# EAGLE design PaxInstrument-T400 (EAGLE 6.5.0)
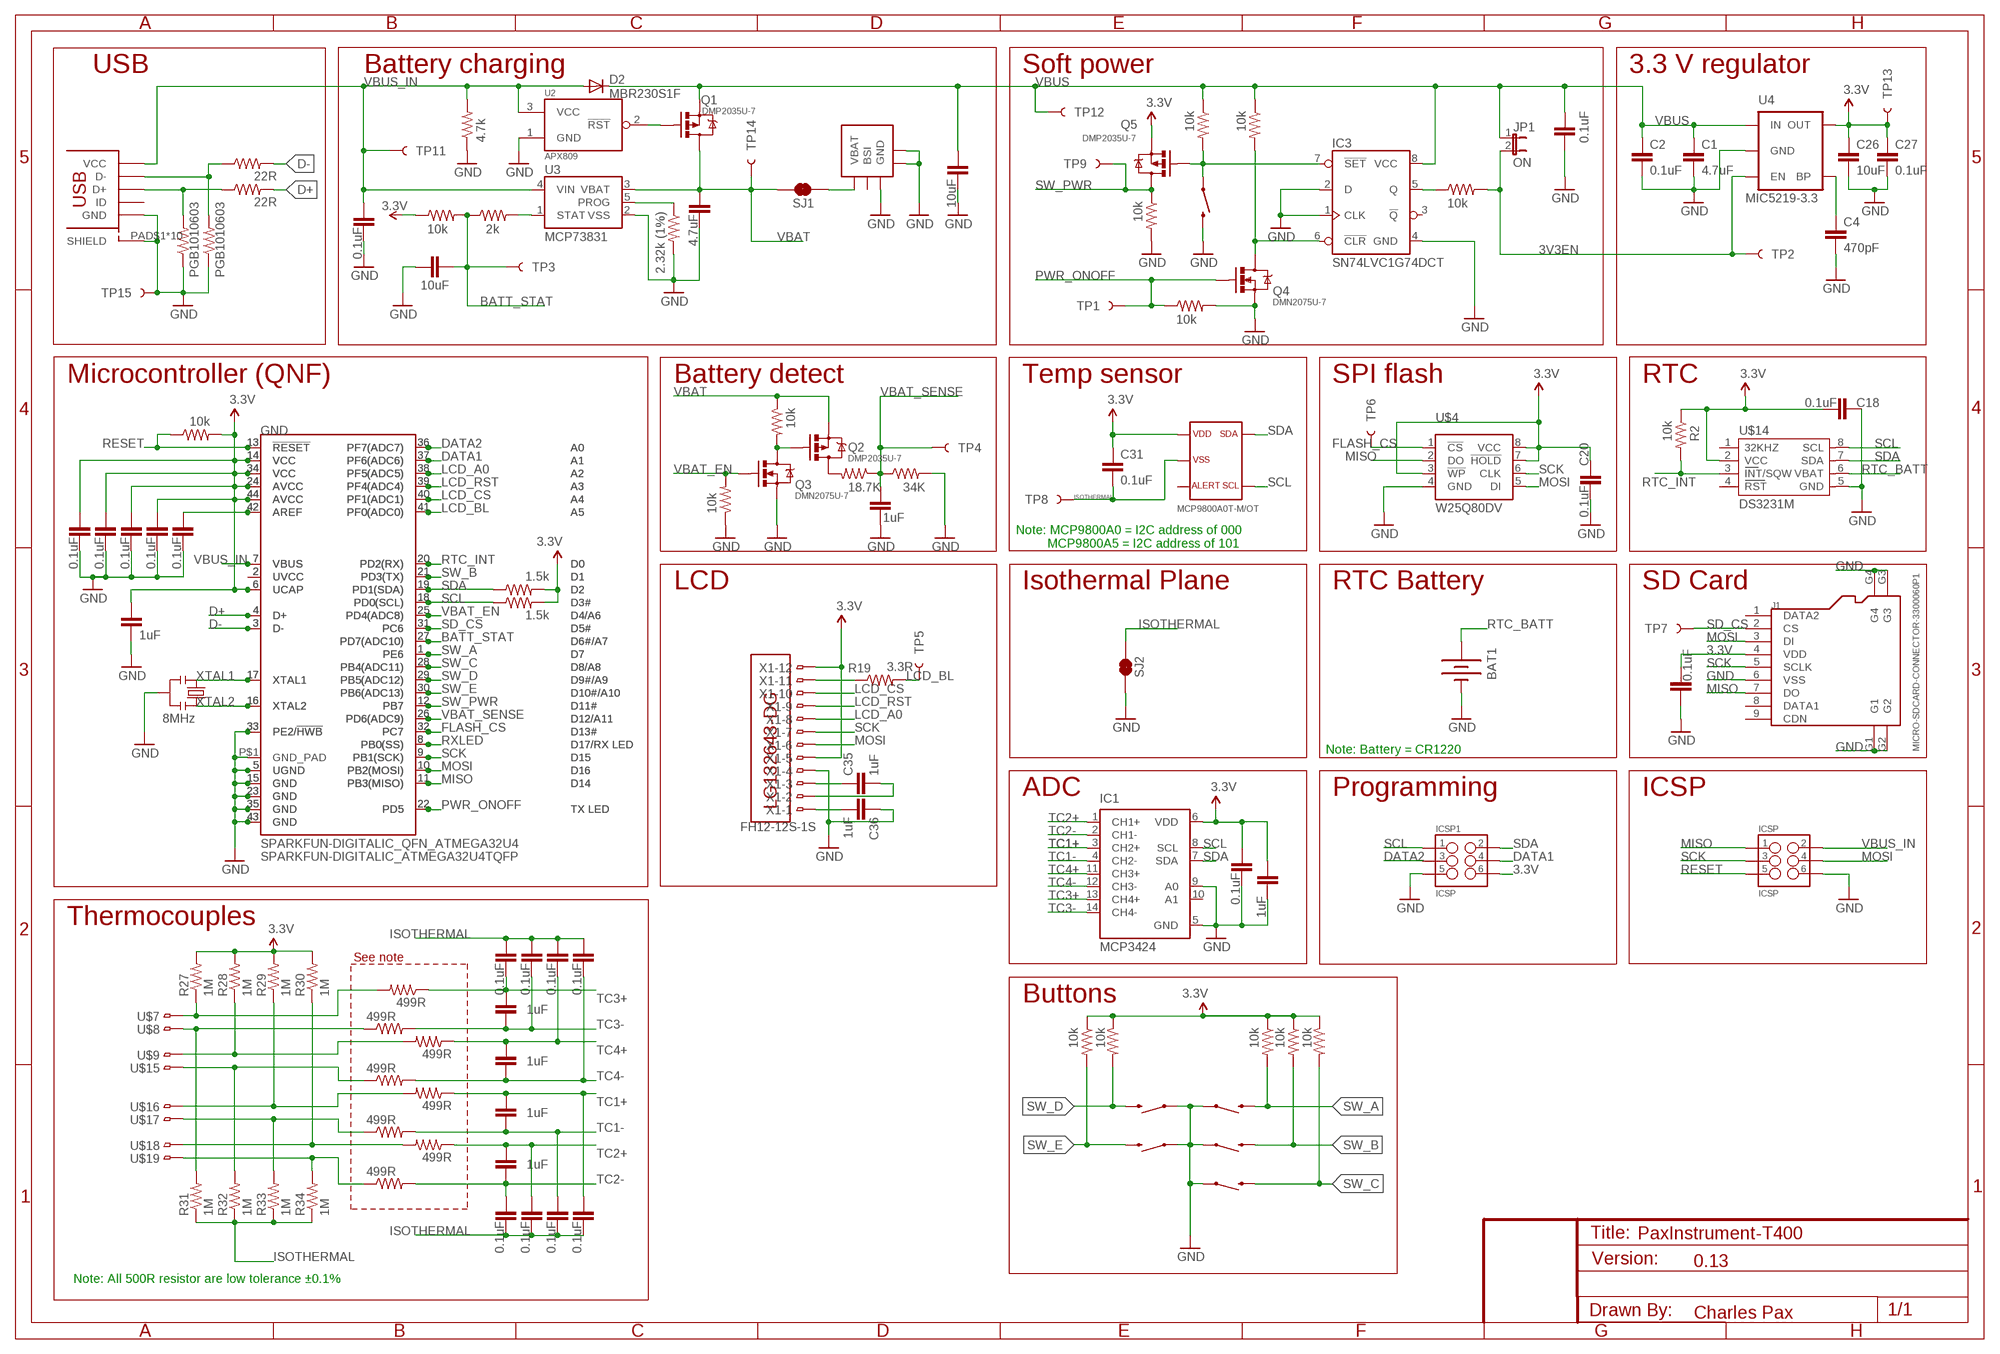
[diagram p0: schematic, sheet 1]

## Parts
BAT1  BATTERY12MM  [BATTCON_12MM]
C1  4.7uF  SPARKFUN-CAPACITORS_CAP0603-CAP  [SPARKFUN-CAPACITORS_0603-CAP]
C2  0.1uF  SPARKFUN-CAPACITORS_CAP0603-CAP  [SPARKFUN-CAPACITORS_0603-CAP]
C3  0.1uF  SPARKFUN-CAPACITORS_CAP0603-CAP  [SPARKFUN-CAPACITORS_0603-CAP]
C4  470pF  SPARKFUN-CAPACITORS_CAP0603-CAP  [SPARKFUN-CAPACITORS_0603-CAP]
C5  0.1uF  SPARKFUN-CAPACITORS_CAP0603-CAP  [SPARKFUN-CAPACITORS_0603-CAP]
C6  0.1uF  SPARKFUN-CAPACITORS_CAP0603-CAP  [SPARKFUN-CAPACITORS_0603-CAP]
C7  1uF  SPARKFUN-CAPACITORS_CAP0603-CAP  [SPARKFUN-CAPACITORS_0603-CAP]
C8  1uF  SPARKFUN-CAPACITORS_CAP0603-CAP  [SPARKFUN-CAPACITORS_0603-CAP]
C9  4.7uF  SPARKFUN-CAPACITORS_CAP0603-CAP  [SPARKFUN-CAPACITORS_0603-CAP]
C10  1uF  SPARKFUN-CAPACITORS_CAP0603-CAP  [SPARKFUN-CAPACITORS_0603-CAP]
C11  1uF  SPARKFUN-CAPACITORS_CAP0603-CAP  [SPARKFUN-CAPACITORS_0603-CAP]
C12  10uF  SPARKFUN-CAPACITORS_CAP0603-CAP  [SPARKFUN-CAPACITORS_0603-CAP]
C13  0.1uF  SPARKFUN-CAPACITORS_CAP0603-CAP  [SPARKFUN-CAPACITORS_0603-CAP]
C14  0.1uF  SPARKFUN-CAPACITORS_CAP0603-CAP  [SPARKFUN-CAPACITORS_0603-CAP]
C15  0.1uF  SPARKFUN-CAPACITORS_CAP0603-CAP  [SPARKFUN-CAPACITORS_0603-CAP]
C16  0.1uF  SPARKFUN-CAPACITORS_CAP0603-CAP  [SPARKFUN-CAPACITORS_0603-CAP]
C17  0.1uF  SPARKFUN-CAPACITORS_CAP0603-CAP  [SPARKFUN-CAPACITORS_0603-CAP]
C18  0.1uF  SPARKFUN-CAPACITORS_CAP0603-CAP  [SPARKFUN-CAPACITORS_0603-CAP]
C19  1uF  SPARKFUN-CAPACITORS_CAP0603-CAP  [SPARKFUN-CAPACITORS_0603-CAP]
C20  0.1uF  SPARKFUN-CAPACITORS_CAP0603-CAP  [SPARKFUN-CAPACITORS_0603-CAP]
C21  0.1uF  SPARKFUN-CAPACITORS_CAP0603-CAP  [SPARKFUN-CAPACITORS_0603-CAP]
C22  10uF  SPARKFUN-CAPACITORS_CAP0603-CAP  [SPARKFUN-CAPACITORS_0603-CAP]
C23  1uF  SPARKFUN-CAPACITORS_CAP0603-CAP  [SPARKFUN-CAPACITORS_0603-CAP]
C24  0.1uF  SPARKFUN-CAPACITORS_CAP0603-CAP  [SPARKFUN-CAPACITORS_0603-CAP]
C25  0.1uF  SPARKFUN-CAPACITORS_CAP0603-CAP  [SPARKFUN-CAPACITORS_0603-CAP]
C26  10uF  SPARKFUN-CAPACITORS_CAP0603-CAP  [SPARKFUN-CAPACITORS_0603-CAP]
C27  0.1uF  SPARKFUN-CAPACITORS_CAP0603-CAP  [SPARKFUN-CAPACITORS_0603-CAP]
C28  0.1uF  SPARKFUN-CAPACITORS_CAP0603-CAP  [SPARKFUN-CAPACITORS_0603-CAP]
C29  0.1uF  SPARKFUN-CAPACITORS_CAP0603-CAP  [SPARKFUN-CAPACITORS_0603-CAP]
C30  1uF  SPARKFUN-CAPACITORS_CAP0603-CAP  [SPARKFUN-CAPACITORS_0603-CAP]
C31  0.1uF  SPARKFUN-CAPACITORS_CAP0603-CAP  [SPARKFUN-CAPACITORS_0603-CAP]
C32  0.1uF  SPARKFUN-CAPACITORS_CAP0603-CAP  [SPARKFUN-CAPACITORS_0603-CAP]
C33  0.1uF  SPARKFUN-CAPACITORS_CAP0603-CAP  [SPARKFUN-CAPACITORS_0603-CAP]
C34  0.1uF  SPARKFUN-CAPACITORS_CAP0603-CAP  [SPARKFUN-CAPACITORS_0603-CAP]
C35  1uF  SPARKFUN-CAPACITORS_CAP0603-CAP  [SPARKFUN-CAPACITORS_0603-CAP]
C36  1uF  SPARKFUN-CAPACITORS_CAP0603-CAP  [SPARKFUN-CAPACITORS_0603-CAP]
C37  0.1uF  SPARKFUN-CAPACITORS_CAP0603-CAP  [SPARKFUN-CAPACITORS_0603-CAP]
D2  MBR230S1F  SPARKFUN-DISCRETESEMI_DIODESOD123SOD123  [SOD123]
GND  SPARKFUN-DIGITALIC_QFN_ATMEGA32U4  [SPARKFUN-DIGITALIC_SPARKFUN-DIGITALIC_QFN-44]
IC1  MCP3424  [SO14]
IC3  SN74LVC1G74DCT  [SSOP8]
ICSP  ICSP  SPARKFUN-CONNECTORS_M03X2PAX  [SPARKFUN-CONNECTORS_2X3_SMT_POSTS_PAXINSTRUMENT]
ICSP1  ICSP  SPARKFUN-CONNECTORS_M03X2PAX  [SPARKFUN-CONNECTORS_2X3_SMT_POSTS_PAXINSTRUMENT]
J1  MICRO-SDCARD-CONNECTOR-3300060P1  [9P-SMD-W-RING]
JP1  ON  JUMPER-2SMD-NO  [SJ_2S-NO]
Q1  DMP2035U-7  MOSFET-PCHANNELSMT  [SOT23]
Q2  DMP2035U-7  MOSFET-PCHANNELSMT  [SOT23]
Q3  DMN2075U-7  MOSFET-NCHANNELSMT  [SOT23]
Q4  DMN2075U-7  MOSFET-NCHANNELSMT  [SOT23]
Q5  DMP2035U-7  MOSFET-PCHANNELSMT  [SOT23]
R1  10k  SPARKFUN-RESISTORS_RESISTOR0603-RES  [SPARKFUN-RESISTORS_0603-RES]
R2  10k  SPARKFUN-RESISTORS_RESISTOR0603-RES  [SPARKFUN-RESISTORS_0603-RES]
R3  2.32k (1%)  SPARKFUN-RESISTORS_RESISTOR0603-RES  [SPARKFUN-RESISTORS_0603-RES]
R4  10k  SPARKFUN-RESISTORS_RESISTOR0603-RES  [SPARKFUN-RESISTORS_0603-RES]
R5  10k  SPARKFUN-RESISTORS_RESISTOR0603-RES  [SPARKFUN-RESISTORS_0603-RES]
R6  10k  SPARKFUN-RESISTORS_RESISTOR0603-RES  [SPARKFUN-RESISTORS_0603-RES]
R7  10k  SPARKFUN-RESISTORS_RESISTOR0603-RES  [SPARKFUN-RESISTORS_0603-RES]
R8  10k  SPARKFUN-RESISTORS_RESISTOR0603-RES  [SPARKFUN-RESISTORS_0603-RES]
R9  22R  SPARKFUN-RESISTORS_RESISTOR0603-RES  [SPARKFUN-RESISTORS_0603-RES]
R10  22R  SPARKFUN-RESISTORS_RESISTOR0603-RES  [SPARKFUN-RESISTORS_0603-RES]
R11  10k  SPARKFUN-RESISTORS_RESISTOR0603-RES  [SPARKFUN-RESISTORS_0603-RES]
R12  10k  SPARKFUN-RESISTORS_RESISTOR0603-RES  [SPARKFUN-RESISTORS_0603-RES]
R13  1.5k  SPARKFUN-RESISTORS_RESISTOR0603-RES  [SPARKFUN-RESISTORS_0603-RES]
R14  1.5k  SPARKFUN-RESISTORS_RESISTOR0603-RES  [SPARKFUN-RESISTORS_0603-RES]
R15  10k  SPARKFUN-RESISTORS_RESISTOR0603-RES  [SPARKFUN-RESISTORS_0603-RES]
R16  10k  SPARKFUN-RESISTORS_RESISTOR0603-RES  [SPARKFUN-RESISTORS_0603-RES]
R17  2k  SPARKFUN-RESISTORS_RESISTOR0603-RES  [SPARKFUN-RESISTORS_0603-RES]
R18  10k  SPARKFUN-RESISTORS_RESISTOR0603-RES  [SPARKFUN-RESISTORS_0603-RES]
R19  3.3R  SPARKFUN-RESISTORS_RESISTOR0603-RES  [SPARKFUN-RESISTORS_0603-RES]
R20  18.7K  SPARKFUN-RESISTORS_RESISTOR0603-RES  [SPARKFUN-RESISTORS_0603-RES]
R21  10k  SPARKFUN-RESISTORS_RESISTOR0603-RES  [SPARKFUN-RESISTORS_0603-RES]
R22  10k  SPARKFUN-RESISTORS_RESISTOR0603-RES  [SPARKFUN-RESISTORS_0603-RES]
R23  10k  SPARKFUN-RESISTORS_RESISTOR0603-RES  [SPARKFUN-RESISTORS_0603-RES]
R24  34K  SPARKFUN-RESISTORS_RESISTOR0603-RES  [SPARKFUN-RESISTORS_0603-RES]
R25  4.7k  SPARKFUN-RESISTORS_RESISTOR0603-RES  [SPARKFUN-RESISTORS_0603-RES]
R27  1M  SPARKFUN-RESISTORS_RESISTOR0603-RES  [SPARKFUN-RESISTORS_0603-RES]
R28  1M  SPARKFUN-RESISTORS_RESISTOR0603-RES  [SPARKFUN-RESISTORS_0603-RES]
R29  1M  SPARKFUN-RESISTORS_RESISTOR0603-RES  [SPARKFUN-RESISTORS_0603-RES]
R30  1M  SPARKFUN-RESISTORS_RESISTOR0603-RES  [SPARKFUN-RESISTORS_0603-RES]
R31  1M  SPARKFUN-RESISTORS_RESISTOR0603-RES  [SPARKFUN-RESISTORS_0603-RES]
R32  1M  SPARKFUN-RESISTORS_RESISTOR0603-RES  [SPARKFUN-RESISTORS_0603-RES]
R33  1M  SPARKFUN-RESISTORS_RESISTOR0603-RES  [SPARKFUN-RESISTORS_0603-RES]
R34  1M  SPARKFUN-RESISTORS_RESISTOR0603-RES  [SPARKFUN-RESISTORS_0603-RES]
R35  499R  SPARKFUN-RESISTORS_RESISTOR0603-RES  [SPARKFUN-RESISTORS_0603-RES]
R36  499R  SPARKFUN-RESISTORS_RESISTOR0603-RES  [SPARKFUN-RESISTORS_0603-RES]
R37  499R  SPARKFUN-RESISTORS_RESISTOR0603-RES  [SPARKFUN-RESISTORS_0603-RES]
R38  499R  SPARKFUN-RESISTORS_RESISTOR0603-RES  [SPARKFUN-RESISTORS_0603-RES]
R39  499R  SPARKFUN-RESISTORS_RESISTOR0603-RES  [SPARKFUN-RESISTORS_0603-RES]
R40  499R  SPARKFUN-RESISTORS_RESISTOR0603-RES  [SPARKFUN-RESISTORS_0603-RES]
R41  499R  SPARKFUN-RESISTORS_RESISTOR0603-RES  [SPARKFUN-RESISTORS_0603-RES]
R42  499R  SPARKFUN-RESISTORS_RESISTOR0603-RES  [SPARKFUN-RESISTORS_0603-RES]
S1  SWITCH-MOMENTARY-2SMD  [TACTILE_SWITCH_SMD]
S2  SWITCH-MOMENTARY-2SMD  [TACTILE_SWITCH_SMD]
S3  SWITCH-MOMENTARY-2SMD  [TACTILE_SWITCH_SMD]
S4  SWITCH-MOMENTARY-2SMD  [TACTILE_SWITCH_SMD]
S5  SWITCH-MOMENTARY-2SMD  [TACTILE_SWITCH_SMD]
S6  SWITCH-MOMENTARY-2SMD  [TACTILE_SWITCH_SMD]
SJ1  JUMPER-PAD-2-NC_BY_TRACE  [PAD-JUMPER-2-NC_BY_TRACE_YES_SILK]
SJ2  JUMPER-PAD-2-NC_BY_TRACE  [PAD-JUMPER-2-NC_BY_TRACE_YES_SILK]
TP1  PWR_ONOFF  TEST-POINTTP_15TH_THRU  [TP_15TH]
TP2  3V3_EN  TEST-POINTTP_15TH_THRU  [TP_15TH]
TP3  BATT_STAT  TEST-POINTTP_15TH_THRU  [TP_15TH]
TP4  VBAT_SENSE  TEST-POINTTP_15TH_THRU  [TP_15TH]
TP5  LCD_BL  TEST-POINTTP_15TH_THRU  [TP_15TH]
TP6  FLASH_CS  TEST-POINTTP_15TH_THRU  [TP_15TH]
TP7  SD_CS  TEST-POINTTP_15TH_THRU  [TP_15TH]
TP8  ISOTHERMAL  TEST-POINTTP_15TH_THRU  [TP_15TH]
TP9  SW_PWR  TEST-POINTTP_15TH_THRU  [TP_15TH]
TP11  VBUS_IN  TEST-POINTTP_15TH_THRU  [TP_15TH]
TP12  VBUS  TEST-POINTTP_15TH_THRU  [TP_15TH]
TP13  3.3V  TEST-POINTTP_15TH_THRU  [TP_15TH]
TP14  VBAT  TEST-POINTTP_15TH_THRU  [TP_15TH]
TP15  GND  TEST-POINTTP_15TH_THRU  [TP_15TH]
U1  MCP9800  [SOT23-5L]
U2  APX809  [SOT23]
U3  MCP73831  [SOT23-5]
U4  MIC5219-3.3V  V_REG_LDOSMD  [SOT23-5]
U$1  USB_MICROSMT+THRUHULE  [USB_MICRO_THRUHOLE]
U$2  BL-5C-CONNECTOR  [BL-5C-CONNECTOR]
U$3  SPARKFUN-DIGITALIC_ATMEGA32U4TQFP  [SPARKFUN-DIGITALIC_SPARKFUN-DIGITALIC_TQFP44]
U$4  W25Q80DV  W25Q80BV  [CHARLESPAX_SOIC8M]
U$5  LG132643-DG  [LG132643-DG]
U$7  TC-MINI-SINGLE  [TC-CLIP-SINGLE]
U$8  TC-MINI-SINGLE  [TC-CLIP-SINGLE]
U$9  TC-MINI-SINGLE  [TC-CLIP-SINGLE]
U$14  DS3231M  [SOIC8]
U$15  TC-MINI-SINGLE  [TC-CLIP-SINGLE]
U$16  TC-MINI-SINGLE  [TC-CLIP-SINGLE]
U$17  TC-MINI-SINGLE  [TC-CLIP-SINGLE]
U$18  TC-MINI-SINGLE  [TC-CLIP-SINGLE]
U$19  TC-MINI-SINGLE  [TC-CLIP-SINGLE]
X1  FH12-12S-1S  [FH12-12S-1SH]
Y1  RESONATORSMD  [RESONATOR-SMD]
Z1  PGB1010603  SPARKFUN-RESISTORS_RESISTOR0603-RES  [SPARKFUN-RESISTORS_0603-RES]
Z2  PGB1010603  SPARKFUN-RESISTORS_RESISTOR0603-RES  [SPARKFUN-RESISTORS_0603-RES]

## Nets
3.3V: C5.1 C18.1 C19.1 C20.2 C21.2 C26.1 C27.1 C29.1 C30.1 C31.1 C32.1 C33.1 C34.1 GND.6(UCAP) GND.14(VCC) GND.24(AVCC) GND.34(VCC) GND.44(AVCC) IC1.6(VDD) ICSP1.6 J1.4(VDD) Q5.2(S) R1.1 R2.1 R4.2 R8.1 R11.1 R12.1 R13.2 R14.2 R15.1 R16.1 R27.2 R28.2 R29.2 R30.2 TP13.P$1 U1.1 U4.5(OUT) U$3.6(UCAP) U$3.14(VCC) U$3.24(AVCC) U$3.34(VCC) U$3.44(AVCC) U$4.3(!WP) U$4.7(!HOLD) U$4.8(VCC) U$14.2(VCC) X1.5 X1.12
3V3EN: JP1.2 R21.2 TP2.P$1 U4.3(EN)
BATT_STAT: C22.1 GND.27(PD7(ADC10)) R1.2 R17.1 TP3.P$1 U$3.27(PD7(ADC10))
D+: GND.4(D+) R9.2 U$3.4(D+)
D-: GND.3(D-) R10.2 U$3.3(D-)
DATA1: GND.37(PF6(ADC6)) ICSP1.4 U$3.37(PF6(ADC6))
DATA2: GND.36(PF7(ADC7)) ICSP1.3 U$3.36(PF7(ADC7))
FLASH_CS: GND.32(PC7) TP6.P$1 U$3.32(PC7) U$4.1(!CS)
GND: BAT1.GND(-) C1.2 C2.2 C3.2 C4.2 C5.2 C6.2 C9.2 C12.2 C18.2 C19.2 C20.1 C21.1 C22.2 C23.2 C26.2 C27.2 C28.2 C29.2 C30.2 C32.2 C33.2 C34.2 C36.1 GND.5(UGND) GND.15(GND) GND.23(GND) GND.33(PE2/!HWB) GND.35(GND) GND.43(GND) GND.P$1(GND_PAD) IC1.5(GND) IC1.9(A0) IC3.1(CLK) IC3.2(D) IC3.4(GND) ICSP1.5 ICSP.6 J1.6(VSS) J1.G1 J1.G2 J1.G3 J1.G4 Q3.2(S) Q4.2(S) R3.2 R18.2 R22.2 R23.1 R24.2 R25.1 S1.1 S2.1 S3.1 S4.1 S5.1 S6.3 SJ2.1 TP15.P$1 U2.1(GND) U3.2(VSS) U4.2(GND) U$1.PAD$1(SHIELD) U$1.PAD$2(SHIELD) U$1.PAD$3(SHIELD) U$1.PAD$4(SHIELD) U$1.PAD$5(SHIELD) U$1.PAD$6(SHIELD) U$1.PAD$7(SHIELD) U$1.PAD$8(SHIELD) U$1.PAD$9(SHIELD) U$1.PAD$10(SHIELD) U$1.PIN$5(GND) U$2.P$3(GND) U$2.P$4 U$2.P$5 U$3.5(UGND) U$3.15(GND) U$3.23(GND) U$3.33(PE2/!HWB) U$3.35(GND) U$3.43(GND) U$4.4(GND) U$14.5(GND) X1.4 Y1.2 Z1.1 Z2.1
ISOTHERMAL: C13.2 C14.2 C15.2 C16.2 C17.1 C24.1 C25.1 C31.2 C37.1 R31.1 R32.1 R33.1 R34.1 SJ2.2 TP8.P$1 U1.2
LCD_A0: GND.38(PF5(ADC5)) U$3.38(PF5(ADC5)) X1.8
LCD_BL: GND.41(PF0(ADC0)) R19.2 TP5.P$1 U$3.41(PF0(ADC0))
LCD_CS: GND.40(PF1(ADC1)) U$3.40(PF1(ADC1)) X1.10
LCD_RST: GND.39(PF4(ADC4)) U$3.39(PF4(ADC4)) X1.9
MISO: GND.11(PB3(MISO)) ICSP.1 J1.7(DO) U$3.11(PB3(MISO)) U$4.2(DO)
MOSI: GND.10(PB2(MOSI)) ICSP.4 J1.3(DI) U$3.10(PB2(MOSI)) U$4.5(DI) X1.6
N$1: C4.1 U4.4(BP)
N$2: R17.2 U3.1(STAT)
N$4: R19.1 X1.11
N$5: R31.2 R36.1 U$8.P$1
N$7: R3.1 U3.5(PROG)
N$10: SJ1.2 U$2.P$1(VBAT)
N$11: R27.1 R35.2 U$7.P$1
N$12: Q1.1(G) U2.2(!RST)
N$13: R29.1 R39.2 U$16.P$1
N$14: R33.2 R41.1 U$17.P$1
N$15: C3.1 GND.42(AREF) U$3.42(AREF)
N$16: R34.2 R42.1 U$19.P$1
N$17: GND.2(UVCC) U$3.2(UVCC)
N$20: Q2.3(D) R20.2
N$25: IC3.7(!SET) Q5.1(G) R6.2 S6.1
N$26: Q2.1(G) Q3.3(D) R5.2
N$27: IC3.6(!CLR) Q4.3(D) R7.2
N$28: IC3.5(Q) R21.1
N$31: R10.1 U$1.PIN$2(D-) Z2.2
N$33: R9.1 U$1.PIN$3(D+) Z1.2
N$34: R32.2 R38.1 U$15.P$1
N$35: R28.1 R37.2 U$9.P$1
N$37: C35.1 X1.3
N$38: C35.2 X1.2
N$39: C36.2 X1.1
N$40: R30.1 R40.2 U$18.P$1
PWR_ONOFF: GND.22(PD5) Q4.1(G) R22.1 TP1.P$1 U$3.22(PD5)
RESET: GND.13(!RESET) ICSP.5 R4.1 U$3.13(!RESET)
RTC_BATT: BAT1.PWR@1(+) U$14.6(VBAT)
RTC_INT: GND.20(PD2(RX)) R2.2 U$3.20(PD2(RX)) U$14.3(INT/SQW)
RXLED: GND.8(PB0(SS)) U$3.8(PB0(SS))
SCK: GND.9(PB1(SCK)) ICSP.3 J1.5(SCLK) U$3.9(PB1(SCK)) U$4.6(CLK) X1.7
SCL: GND.18(PD0(SCL)) IC1.8(SCL) ICSP1.1 R14.1 U1.4 U$3.18(PD0(SCL)) U$14.8(SCL)
SD_CS: GND.31(PC6) J1.2(CS) TP7.P$1 U$3.31(PC6)
SDA: GND.19(PD1(SDA)) IC1.7(SDA) ICSP1.2 R13.1 U1.5 U$3.19(PD1(SDA)) U$14.7(SDA)
SW_A: GND.1(PE6) R8.2 S3.3 U$3.1(PE6)
SW_B: GND.21(PD3(TX)) R11.2 S2.3 U$3.21(PD3(TX))
SW_C: GND.28(PB4(ADC11)) R12.2 S1.3 U$3.28(PB4(ADC11))
SW_D: GND.29(PB5(ADC12)) R15.2 S4.3 U$3.29(PB5(ADC12))
SW_E: GND.30(PB6(ADC13)) R16.2 S5.3 U$3.30(PB6(ADC13))
SW_PWR: GND.12(PB7) Q5.3(D) R18.1 TP9.P$1 U$3.12(PB7)
TC1+: C10.1 C16.1 IC1.3(CH2+) R39.1
TC1-: C10.2 C15.1 IC1.4(CH2-) R41.2
TC2+: C11.1 C14.1 IC1.1(CH1+) R40.1
TC2-: C11.2 C13.1 IC1.2(CH1-) R42.2
TC3+: C7.1 C17.2 IC1.13(CH4+) R35.1
TC3-: C7.2 C24.2 IC1.14(CH4-) R36.2
TC4+: C8.1 C25.2 IC1.11(CH3+) R37.1
TC4-: C8.2 C37.2 IC1.12(CH3-) R38.2
VBAT: C9.1 Q1.3(D) Q2.2(S) R5.1 SJ1.1 TP14.P$1 U3.3(VBAT)
VBAT_EN: GND.25(PD4(ADC8)) Q3.1(G) R23.2 U$3.25(PD4(ADC8))
VBAT_SENSE: C23.1 GND.26(PD6(ADC9)) R20.1 R24.1 TP4.P$1 U$3.26(PD6(ADC9))
VBUS [power]: C1.1 C2.1 C12.1 C28.1 D2.C IC3.8(VCC) JP1.1 Q1.2(S) R6.1 R7.1 TP12.P$1 U4.1(IN)
VBUS_IN [power]: C6.1 D2.A GND.7(VBUS) ICSP.2 R25.2 TP11.P$1 U2.3(VCC) U3.4(VIN) U$1.PIN$1(VCC) U$3.7(VBUS)
XTAL1: GND.17(XTAL1) U$3.17(XTAL1) Y1.1
XTAL2: GND.16(XTAL2) U$3.16(XTAL2) Y1.3
Unconnected: IC1.10(A1) IC3.3(!Q) J1.1(DATA2) J1.8(DATA1) J1.9(CDN) U1.3 U$1.PIN$4(ID) U$2.P$2(BSI) U$14.1(32KHZ) U$14.4(RST)

## Notes on the sheet
- USB | Battery charging | Soft power | 3.3 V regulator
- MIC5219-3.3
- Microcontroller (QNF) | Battery detect | Temp sensor | SPI flash | RTC
- Note: MCP9800A0 = I2C address of 000
           MCP9800A5 = I2C address of 101
- LCD | Isothermal Plane | RTC Battery | SD Card
- 8MHz
- Note: Battery = CR1220
- ADC | Programming | ICSP
- Thermocouples
- See note
- Buttons
- 0.13
- Note: All 500R resistor are low tolerance ±0.1%
- Charles Pax

## Library data of the parts
BAT1 = SparkFun-Electromechanical:BATTERY: Battery Holders Various common sizes : AA, AAA, 20mm coin cell and 12mm coin cell. 20MM_4LEGS, BATT-10373; MF: Keystone Electronics; MPN: 3000TR
C1-C37 = PaxInstrument-T400:SPARKFUN-CAPACITORS_CAP: Capacitor Standard 0603 ceramic capacitor, and 0.1" leaded capacitor.
D2 = PaxInstrument-T400:SPARKFUN-DISCRETESEMI_DIODE: Diode These are standard reverse protection diodes and small signal diodes. SMA package can handle up to about 1A. SOD-323 can handle about 200mA. What the SOD-323 package when ordering, there are some mfgs out there that are 5-pin packages.; MF: DIODES INC; MPN: MBR230S1F-7
GND = PaxInstrument-T400:SPARKFUN-DIGITALIC_QFN_ATMEGA32U4; MF: Atmel; MPN: ATMEGA32U4-MU
IC1 = JeeLabs:MCP3424: 18-Bit, 4-Channel Sampling ANALOG-TO-DIGITAL CONVERTER with I2C? Interface Source: www.ti.com .. ADS7828.pdf; MF: Microchip Technology; MPN: MCP3424-E/SL
IC3 = PaxInstrument-T400:SN74LVC1G74; MF: Texas Instruments; MPN: SN74LVC1G74DCTR
ICSP ICSP1 = PaxInstrument-T400:SPARKFUN-CONNECTORS_M03X2: 2x3 .1" header. Shrouded, with keying- CONN-10681 SMT- CONN-11415 Pogo pins- HW-11044; MF: FCI; MPN: 95278-101A06LF
J1 = PaxInstrument-T400:MICRO-SDCARD-CONNECTOR: Micro SD Card; MF: SUNTECH; MPN: ST-TF-003A
JP1 = SparkFun-Passives:JUMPER-2: Jumper Basic 0.1" spaced jumper. Use with breakaway headers.; MF: N/A; MPN: N/A
Q1 Q2 Q5 = PaxInstrument-T400:MOSFET-PCHANNEL: Generic PMOSFET; MF: DIODES INC; MPN: DMP2035U-7
Q3 Q4 = PaxInstrument-T400:MOSFET-NCHANNEL: Generic NMOSFET; MF: DIODES INC; MPN: DMN2075U-7
R1-R7 R9 R10 R13 R14 R17-R25 R27-R34 = PaxInstrument-T400:SPARKFUN-RESISTORS_RESISTOR: Resistor Basic schematic elements and footprints for 0603, 1206, and PTH resistors.
R8 R11 R12 R15 R16 = PaxInstrument-T400:SPARKFUN-RESISTORS_RESISTOR: Resistor Basic schematic elements and footprints for 0603, 1206, and PTH resistors.; POPULATE: DNP
R35-R42 = PaxInstrument-T400:SPARKFUN-RESISTORS_RESISTOR: Resistor Basic schematic elements and footprints for 0603, 1206, and PTH resistors.; MF: Vishay; MPN: TNPW0603499RBEEA
S1-S6 = SparkFun-Electromechanical:SWITCH-MOMENTARY-2: Various NO switches- pushbuttons, reed, etc; MF: C&K Components; MPN: RS-187R05A2-DS MT RT
SJ1 SJ2 = SparkFun-Passives:JUMPER-PAD-2-NC_BY_TRACE; MF: N/A; MPN: N/A
TP1-TP9 TP11-TP15 = PaxInstrument-T400:TEST-POINT: Bare copper test points for troubleshooting or ICT; MF: N/A; MPN: N/A
U1 = newparts_2010:MCP9800: Temperature sensor I2C output, Microchip. Farnell 1439485; MF: Microchip Technology; MPN: MCP9800A0T-M/OT
U2 = PaxInstrument-T400:APX809; MF: DIODES INC; MPN: APX809-44SAG-7
U3 = SparkFun-PowerIC:MCP73831: Miniature single cell, fully integrated Li-Ion, Li-polymer charge management controller http://ww1.microchip.com/downloads/en/DeviceDoc/21984a.pdf IC-09995; MF: Microchip Technology; MPN: MCP73832T-2DCI/OT
U4 = SparkFun:V_REG_LDO: Voltage Regulator LDO Standard 150mA LDO voltage regulator in SOT-23 layout. Micrel part MIC5205. BP (by-pass) pin is used to lower output noise with 470pF cap.; MF: Micrel; MPN: MIC5219-3.3YM5 TR
U$1 = blinkinlabs:USB_MICRO; MF: FCI; MPN: 10118194-0001LF
U$2 = charlespax:BL-5C-CONNECTOR; MPN: BC-4-3P (77H)
U$3 = PaxInstrument-T400:SPARKFUN-DIGITALIC_ATMEGA32U4: Atmel 44-pin 8-bit Microcontroller with 32KBytes of ISP Flash and USB Controller ----- Please use the QFN-44-NOPAD_1:1 package for the footprint of all boards using a 32U4. Route traces directly away from the pads as much as possible.; MF: Atmel; MPN: ATMEGA32U4-AU
U$4 = PaxInstrument-T400:W25Q80BV; MF: Winbond Electronics; MPN: W25Q80DVSSIG-ND
U$5 = charlespax:LG132643-DG; MPN: LG132643-DW
U$7-U$9 U$15-U$19 = PaxInstruments-Connectors:TC-MINI-SINGLE; MF: Pax Instrument; MPN: Thermo-clip2
U$14 = charlespax:DS3231M; MF: Maxim Integrated; MPN: DS3231MZ+
X1 = PaxInstrument-T400:FH12-12S-1S; MF: Hirose Connector; MPN: FH12-12S-1SH(55)
Y1 = SparkFun:RESONATOR: Resonator Small SMD resonator. This is the itty bitty 10/20MHz resonators with built in caps. CSTCE10M0G55 and CSTCE20M0V53. Footprint has been reviewed closely but hasn't been tested yet.; MF: Murata Electronics; MPN: CSTCE8M00G52-R0
Z1 Z2 = PaxInstrument-T400:SPARKFUN-RESISTORS_RESISTOR: Resistor Basic schematic elements and footprints for 0603, 1206, and PTH resistors.; MF: Littelfuse; MPN: PGB1010603NRHF

## Net classes
0 default: width 0.203 mm, drill 0.33 mm
1 power: width 0.305 mm

## Board
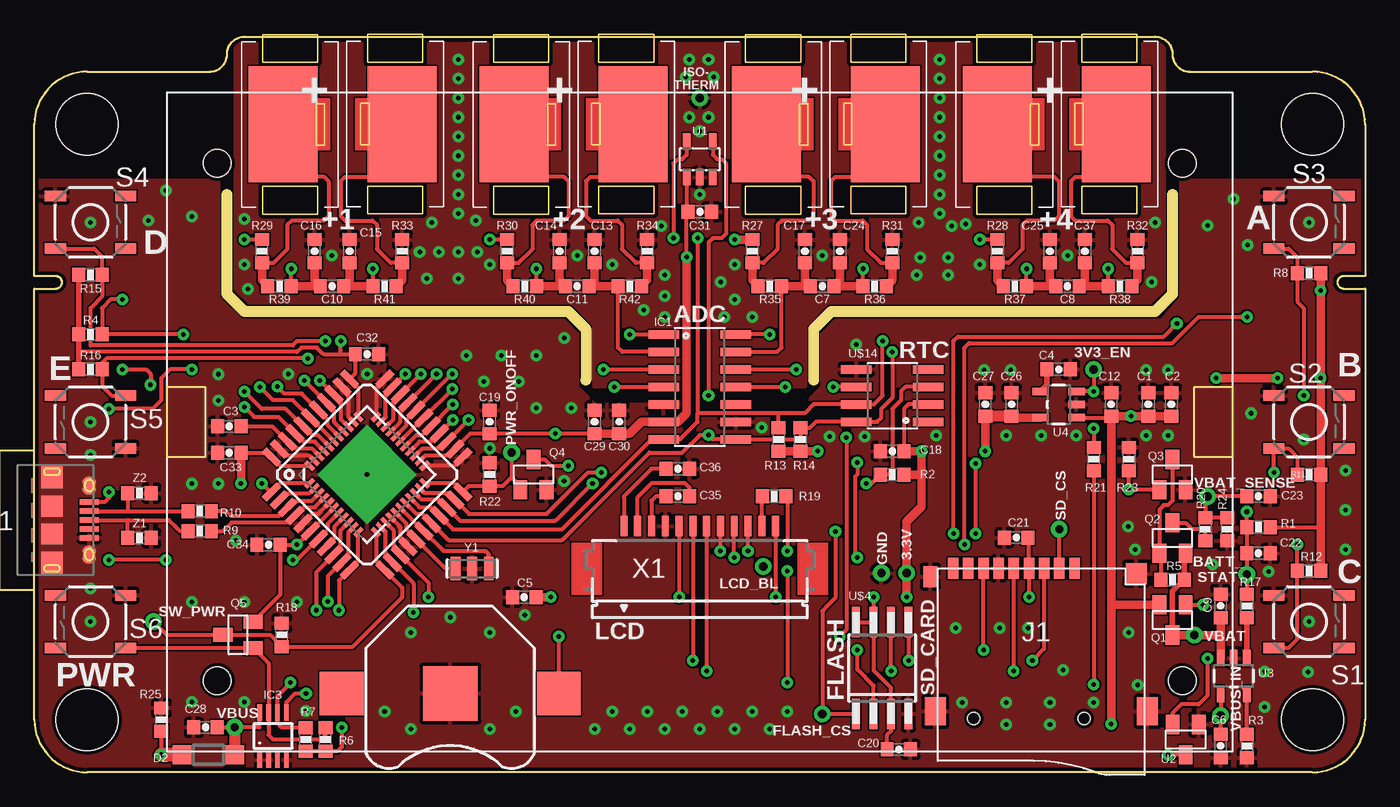
[diagram p1: board, top side]
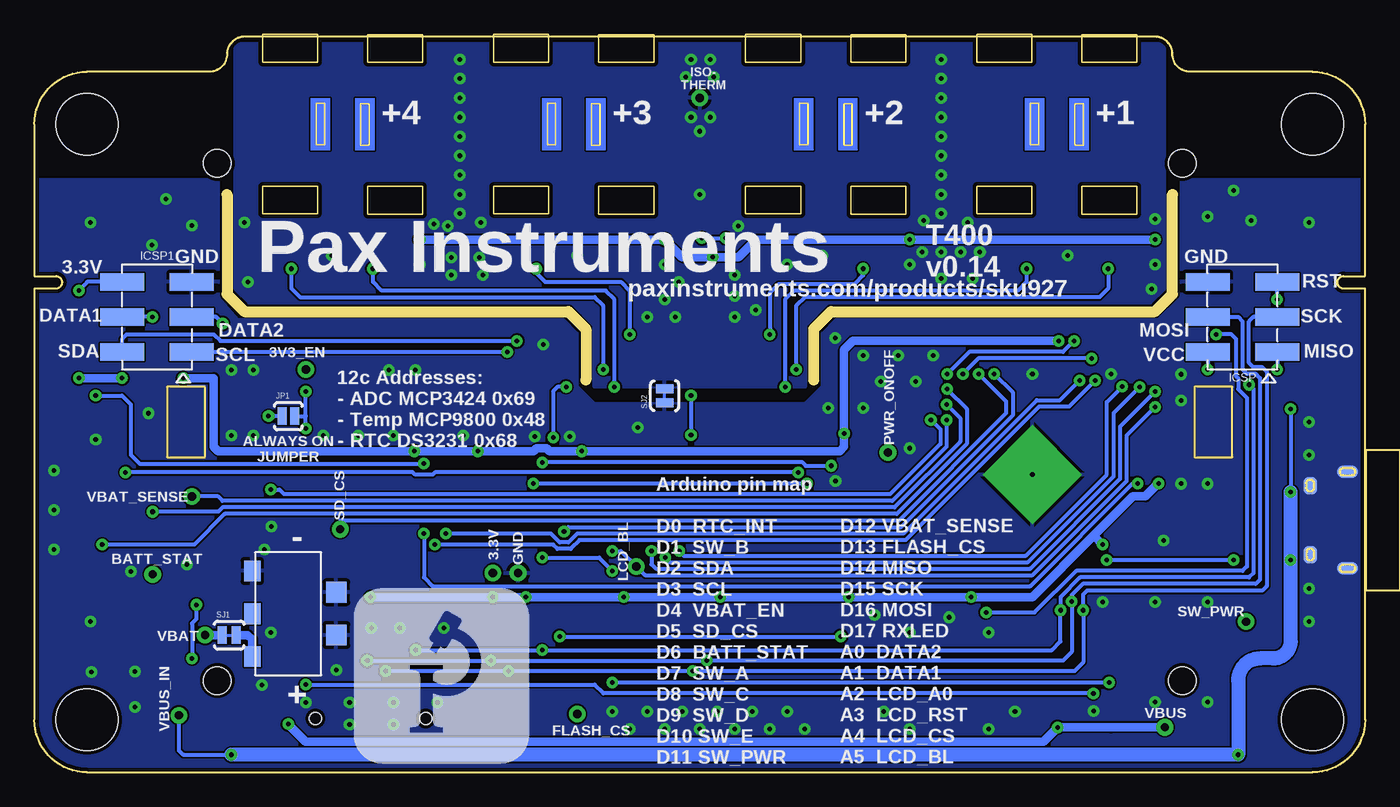
[diagram p2: board, bottom side, seen from below]

Size 96.52 x 53.34 mm. Coordinates in mm from the lower left corner, seen from the top.
Outline: 92.71,0 3.81,0 arc-90 0,3.81 0,35.07 1.55,35.07 arc90 2,35.52 arc90 1.55,35.97 0,35.97 0,46.99 arc-90 3.81,50.8 12.7,50.8 arc90 13.97,52.07 arc-90 15.24,53.34 81.28,53.34 arc-90 82.55,52.07 arc90 83.82,50.8 92.71,50.8 arc-90 96.52,46.99 96.52,35.97 94.97,35.97 arc90 94.52,35.52 arc90 94.97,35.07 96.52,35.07 96.52,3.81 arc-90 92.71,0
Copper layers (1*16): Top 0.035mm / dielectric 1.5mm / Bottom 0.035mm
Design rules "PaxInstrument-T400": minimum track width 6mil, minimum drill 13mil, track to track 5mil, track to pad 5mil, pad to pad 5mil, via to via 5mil, smd to smd 5mil, copper to edge 10mil, drill to drill 8mil, minimum pad ring 12mil, minimum via ring 10mil, stop-mask expansion 4mil, vias tented up to drill 25mil, thermal gap 10mil
Holes 4.5 mm at 92.71,3.81 92.71,46.99 3.81,46.99 3.81,3.81
tKeepout: area 0.3,0.3 to 7.3,7.3; area 0.3,43.5 to 7.3,50.5; area 89.2,43.5 to 96.2,50.5; area 89.2,0.3 to 96.2,7.3
Milling: 14 lines

### Footprints (pad centres in the part's own frame; a part is rotated, then mirrored left to right if it is on the bottom)
BATTCON_12MM = smd 3.962 x 3.962: GND 0,0 | smd 3.175 x 3.175: PWR@1 -7.874,0; PWR@2 7.874,0
SPARKFUN-CAPACITORS_0603-CAP = smd 0.94 x 1.016: 1 -0.85,0; 2 0.85,0
SOD123 = smd 1.4 x 1.4: A 1.9,0; C -1.9,0
SPARKFUN-DIGITALIC_SPARKFUN-DIGITALIC_QFN-44 = smd 0.8 x 0.3: 1 -3.4,2.5; 2 -3.4,2; 3 -3.4,1.5; 4 -3.4,1; 5 -3.4,0.5; 6 -3.4,0; 7 -3.4,-0.5; 8 -3.4,-1; 9 -3.4,-1.5; 10 -3.4,-2; 11 -3.4,-2.5; 23 3.4,-2.5; 24 3.4,-2; 25 3.4,-1.5; 26 3.4,-1; 27 3.4,-0.5; 28 3.4,0; 29 3.4,0.5; 30 3.4,1; 31 3.4,1.5; 32 3.4,2; 33 3.4,2.5 | smd 0.3 x 0.8: 12 -2.5,-3.4; 13 -2,-3.4; 14 -1.5,-3.4; 15 -1,-3.4; 16 -0.5,-3.4; 17 0,-3.4; 18 0.5,-3.4; 19 1,-3.4; 20 1.5,-3.4; 21 2,-3.4; 22 2.5,-3.4; 34 2.5,3.4; 35 2,3.4; 36 1.5,3.4; 37 1,3.4; 38 0.5,3.4; 39 0,3.4; 40 -0.5,3.4; 41 -1,3.4; 42 -1.5,3.4; 43 -2,3.4; 44 -2.5,3.4 | drill 0.33 pad 5.08 square: P$1 0,0
SO14 = smd 0.61 x 2.21: 1 -3.81,-2.616; 2 -2.54,-2.616; 3 -1.27,-2.616; 4 0,-2.616; 5 1.27,-2.616; 6 2.54,-2.616; 7 3.81,-2.616; 8 3.81,2.616; 9 2.54,2.616; 10 1.27,2.616; 11 0,2.616; 12 -1.27,2.616; 13 -2.54,2.616; 14 -3.81,2.616
SSOP8 = smd 1.2 x 0.35: 1 -1.7,0.975; 2 -1.7,0.325; 3 -1.7,-0.325; 4 -1.7,-0.975; 5 1.7,-0.975; 6 1.7,-0.325; 7 1.7,0.325; 8 1.7,0.975
SPARKFUN-CONNECTORS_2X3_SMT_POSTS_PAXINSTRUMENT = smd 1.27 x 3.2: 1 -2.54,-2.52; 2 -2.54,2.52; 3 0,-2.52; 4 0,2.52; 5 2.54,-2.52; 6 2.54,2.52
9P-SMD-W-RING = smd 1.524 x 0.762: 1 -7.493,2.414; 2 -7.493,1.314; 3 -7.493,0.214; 4 -7.493,-0.886; 5 -7.493,-1.986; 6 -7.493,-3.086; 7 -7.493,-4.186; 8 -7.493,-5.286; 9 -7.493,-6.386 | smd 1.524 x 1.016: G1 -6.893,-8.032 | smd 2.032 x 1.524: G2 2.88,-7.686; G3 2.88,7.714 | smd 1.524 x 1.524: G4 -7.101,6.895 | hole 0.889: 3.407,-4.886; 3.407,3.114
SJ_2S-NO = smd 0.635 x 1.27: 1 -0.45,0; 2 0.45,0
SOT23 = smd 1 x 1.4: 1 -0.95,-1.1; 2 0.95,-1.1; 3 0,1.1
SPARKFUN-RESISTORS_0603-RES = smd 0.94 x 1.016: 1 -0.85,0; 2 0.85,0
TACTILE_SWITCH_SMD = smd 1.524 x 0.762: 1 -2.54,1.905; 2 2.54,1.905; 3 -2.54,-1.905; 4 2.54,-1.905
PAD-JUMPER-2-NC_BY_TRACE_YES_SILK = smd 0.635 x 1.27: 1 -0.508,0; 2 0.508,0
TP_15TH = drill 0.6 pad 1.168: P$1 0,0
SOT23-5L = smd 0.55 x 1.2: 1 -0.95,-1.3; 2 0,-1.3; 3 0.95,-1.3; 4 0.95,1.3; 5 -0.95,1.3
SOT23-5 = smd 0.55 x 1.2: 1 -0.95,-1.3; 2 0,-1.3; 3 0.95,-1.3; 4 0.95,1.3; 5 -0.95,1.3
USB_MICRO_THRUHOLE = smd 1.645 x 1.55: PAD$1 -3.123,0; PAD$4 3.123,0 | smd 1.5 x 1.55: PAD$2 -1,0; PAD$3 1,0 | smd 1.25 x 0.95: PAD$5 -2.5,2.7; PAD$6 2.5,2.7 | smd 0.9 x 1.55 bottom: PAD$7 -3.5,0; PAD$8 3.5,0 | smd 1.25 x 0.95 bottom: PAD$9 -2.5,2.7; PAD$10 2.5,2.7 | smd 0.4 x 1.35: PIN$1 -1.3,2.7; PIN$2 -0.65,2.7; PIN$3 0,2.7; PIN$4 0.65,2.7; PIN$5 1.3,2.7
BL-5C-CONNECTOR = smd 1.5 x 1.2: P$1 3.1,-0.2; P$2 0,-0.2; P$3 -3.1,-0.2 | smd 1.5 x 1.5: P$4 1.55,5.9; P$5 -1.55,5.9
SPARKFUN-DIGITALIC_SPARKFUN-DIGITALIC_TQFP44 = smd 1.5 x 0.5: 1 -5.8,4; 2 -5.8,3.2; 3 -5.8,2.4; 4 -5.8,1.6; 5 -5.8,0.8; 6 -5.8,0; 7 -5.8,-0.8; 8 -5.8,-1.6; 9 -5.8,-2.4; 10 -5.8,-3.2; 11 -5.8,-4; 23 5.8,-4; 24 5.8,-3.2; 25 5.8,-2.4; 26 5.8,-1.6; 27 5.8,-0.8; 28 5.8,0; 29 5.8,0.8; 30 5.8,1.6; 31 5.8,2.4; 32 5.8,3.2; 33 5.8,4 | smd 0.5 x 1.5: 12 -4,-5.8; 13 -3.2,-5.8; 14 -2.4,-5.8; 15 -1.6,-5.8; 16 -0.8,-5.8; 17 0,-5.8; 18 0.8,-5.8; 19 1.6,-5.8; 20 2.4,-5.8; 21 3.2,-5.8; 22 4,-5.8; 34 4,5.8; 35 3.2,5.8; 36 2.4,5.8; 37 1.6,5.8; 38 0.8,5.8; 39 0,5.8; 40 -0.8,5.8; 41 -1.6,5.8; 42 -2.4,5.8; 43 -3.2,5.8; 44 -4,5.8
CHARLESPAX_SOIC8M = smd 0.6 x 2.2: 1 -1.905,-3.33; 2 -0.635,-3.33; 3 0.635,-3.33; 4 1.905,-3.33; 5 1.905,3.33; 6 0.635,3.33; 7 -0.635,3.33; 8 -1.905,3.33
LG132643-DG = hole 2: -35,-18.75; 35,-18.75; 35,18.75; -35,18.75
TC-CLIP-SINGLE = smd 5 x 8.4: P$1 -0.5,0
SOIC8 = smd 0.61 x 2.21: 1 -1.905,-2.616; 2 -0.635,-2.616; 3 0.635,-2.616; 4 1.905,-2.616; 5 1.905,2.616; 6 0.635,2.616; 7 -0.635,2.616; 8 -1.905,2.616
FH12-12S-1SH = smd 0.5 x 1.5: 1 -5.5,2.297; 2 -4.5,2.297; 3 -3.5,2.297; 4 -2.5,2.297; 5 -1.5,2.297; 6 -0.5,2.297; 7 0.5,2.297; 8 1.5,2.297; 9 2.5,2.297; 10 3.5,2.297; 11 4.5,2.297; 12 5.5,2.297
RESONATOR-SMD = smd 0.7 x 1.7: 1 -1.2,0; 2 0,0; 3 1.2,0

### Placement (x,y rotation side)
BAT1  30.16,5.71 180 top
C1  80.8,26.67 90 top
C2  82.47,26.67 90 top
C3  14.13,25.08 180 top
C4  74.3,29.21 0 top
C5  35.53,12.7 180 top
C6  86.04,1.91 270 top
C7  57.15,35.24 0 top
C8  74.93,35.24 0 top
C9  86.04,12.06 90 top
C10  21.59,35.24 0 top
C11  39.37,35.24 0 top
C12  78.11,26.67 90 top
C13  40.64,37.78 90 top
C14  38.1,37.78 90 top
C15  22.86,37.78 90 top
C16  20.32,37.78 90 top
C17  55.88,37.78 270 top
C18  62.23,23.28 180 top
C19  33.02,25.4 90 top
C20  62.71,1.65 180 top
C21  71.22,17.02 0 top
C22  88.8,15.88 0 top
C23  88.8,20 0 top
C24  58.42,37.78 270 top
C25  73.66,37.78 270 top
C26  70.88,26.67 90 top
C27  68.98,26.67 90 top
C28  12.41,3.26 180 top
C29  40.64,25.4 90 top
C30  42.42,25.4 90 top
C31  48.26,40.64 0 top
C32  24.13,30.32 0 top
C33  14.13,23.18 180 top
C34  16.99,16.51 180 top
C35  46.67,20.01 0 top
C36  46.67,22.01 180 top
C37  76.2,37.78 270 top
D2  12.62,1.27 180 top
GND  24.13,21.59 45 top
IC1  48.26,27.94 270 top
IC3  17.3,2.62 90 top
ICSP  8.89,33.02 90 bottom
ICSP1  87.63,33.02 90 bottom
J1  73.03,7.3 270 top
JP1  78.11,25.82 0 bottom
Q1  82.55,11.04 180 top
Q2  82.55,16.99 0 top
Q3  82.55,21.59 0 top
Q4  36.2,21.59 0 top
Q5  14.76,9.97 90 top
R1  88.8,17.78 180 top
R2  62.23,21.59 180 top
R3  87.95,1.91 270 top
R4  4.06,31.75 180 top
R5  82.55,13.97 180 top
R6  21.11,2.38 90 top
R7  19.68,2.38 90 top
R8  92.46,36.2 180 top
R9  11.99,17.48 0 top
R10  11.99,18.94 0 top
R11  92.46,21.59 180 top
R12  92.46,14.61 180 top
R13  53.98,24.13 270 top
R14  55.56,24.13 270 top
R15  4.06,36.07 0 top
R16  4.06,29.21 0 top
R17  87.94,12.06 270 top
R18  17.94,9.97 90 top
R19  53.66,20.01 0 top
R20  84.93,17.62 270 top
R21  76.83,22.7 90 top
R22  33.02,21.59 90 top
R23  79.38,22.7 270 top
R24  86.52,17.62 270 top
R25  9.21,3.81 270 top
R27  52.07,37.78 90 top
R28  69.85,37.78 90 top
R29  16.51,37.78 90 top
R30  34.29,37.78 90 top
R31  62.23,37.78 270 top
R32  80.01,37.78 270 top
R33  26.67,37.78 270 top
R34  44.45,37.78 270 top
R35  53.34,35.24 180 top
R36  60.96,35.24 180 top
R37  71.12,35.24 180 top
R38  78.74,35.24 180 top
R39  17.78,35.24 180 top
R40  35.56,35.24 180 top
R41  25.4,35.24 180 top
R42  43.18,35.24 180 top
S1  92.46,10.92 0 top
S2  92.46,25.4 0 top
S3  92.46,39.88 0 top
S4  4.06,39.88 0 top
S5  4.06,25.4 180 top
S6  4.06,10.92 180 top
SJ1  82.39,9.95 0 bottom
SJ2  50.8,27.3 90 bottom
TP1  34.61,23.18 0 top
TP2  76.83,29.21 180 top
TP3  87.94,14.35 270 top
TP4  85.09,20 90 top
TP5  52.86,14.92 0 top
TP6  57.15,4.23 0 top
TP7  74.34,17.62 0 top
TP8  48.26,48.9 0 top
TP9  8.63,10.92 0 bottom
TP11  86.04,4.13 0 top
TP12  14.52,3.26 0 bottom
TP13  63.26,14.45 0 bottom
TP14  84.14,9.95 90 top
TP15  61.44,14.45 0 top
U1  48.26,44.45 0 top
U2  83.5,2.37 180 top
U3  87,6.99 180 top
U4  74.3,26.67 90 top
U$1  1.27,18.29 270 top
U$2  80.52,11.5 270 bottom
U$3  24.13,21.59 45 top
U$4  61.5,7.56 0 top
U$5  48.26,25.4 0 bottom
U$6  [PAX-LOGO-0.5IN]  73.34,0.64 0 bottom
U$7  53.59,46.99 0 top
U$8  61.21,46.99 180 top
U$9  70.36,46.99 0 top
U$14  62.23,27.3 90 top
U$15  77.98,46.99 180 top
U$16  18.54,46.99 0 top
U$17  26.16,46.99 180 top
U$18  35.31,46.99 0 top
U$19  42.93,46.99 180 top
X1  48.26,15.56 0 top
Y1  31.75,14.76 180 top
Z1  7.62,16.99 180 top
Z2  7.62,20.24 180 top

### Tracks (layer width: path | path; a pad name or v marks a point on that pad's centre or on a via)
3.3V  (via drill 0.33)
  Top 0.305: U$4.8 U$4.7 | U1.1 47.31,40.74 C31.1 47.31,40.54 v47.31,37.36 | C20.2 61.86,2.71 62.13,2.98 U$4.3 62.13,6.13 60.87,7.4 U$4.7 | GND.24 28.31,22.94 30,22.94 U$3.24 31.61,24.55 C19.1 v37.78,24.55 C29.1 | GND.34 23.49,27.88 U$3.34 23.28,28.94 C32.1 22.23,30.32 | GND.44 17.84,22.23 U$3.44 16.89,23.18 C33.1 | R29.2 v15.24,38.63 | R30.2 v33.02,38.63 | R28.2 v68.58,38.63 | X1.5 v46.76,12.7 | X1.12 v53.76,12.7 | 73.11,25.72 U4.5 73.11,25.61 | 22.23,30.32 v22.23,31.27 | R1.1 93.31,17.78 | U$14.2 63.4,26.67 63.08,26.35 C18.1 | 3.21,30.48 19.05,30.48 19.37,30.8 20.48,30.8 20.95,30.32 22.23,30.32 | v60.87,12.7 U$4.7 | v72.14,12.7 J1.4 72.14,16.51 C21.2 | GND.6 U$3.6 v19.05,16.51 C34.1 17.84,12.89 Q5.2 | GND.14 26.04,17.56 26.04,16.29 U$3.14 28.57,13.75 v28.57,12.7
  Top 0.406: R15.1 R4.2 3.21,30.48 R16.1 | 70.88,25.72 C26.1
  Top 0.61: R12.1 93.31,17.78 R11.1 v93.31,28.57 v93.31,34.92 R8.1 | C29.1 C30.1 43.18,24.55 44.03,25.4 IC1.6 46.67,25.4 47.31,26.04 v47.31,37.36 | U4.5 70.88,25.72 | R13.2 R14.2 v56.83,23.28 | v37.47,12.7 C5.1 | v90.17,28.57 v85.72,28.57 | v50.8,38.63 R27.2 | C33.1 v14.98,20.95 | C27.1 v68.98,23.28 | v63.26,12.7 TP13.P$1 63.26,18.18 64.35,19.27 64.35,21.59 | 64.35,21.59 v64.35,23.28 C18.1 | R2.1 64.35,21.59
  Top 0.813: C26.1 C27.1
  Bottom 0.305: ICSP1.6 92.71,35.56 92.71,35.52 v93.31,34.92
  Bottom 0.61: v15.24,38.63 v33.02,38.63 33.04,38.61 44.2,38.61 45.44,37.36 v47.31,37.36 49.53,37.36 v50.8,38.63 v68.58,38.63 | v22.23,31.27 37.15,31.27 37.78,30.64 v37.78,24.55 37.78,23.6 38.1,23.28 v56.83,23.28 59.16,23.28 59.37,23.5 60.11,23.5 60.33,23.28 v64.35,23.28 v68.98,23.28 83.19,23.28 83.5,23.6 83.5,28.57 v85.72,28.57 | v93.31,28.57 v90.17,28.57 | 19.76,17.07 24.13,12.7 v28.57,12.7 v37.47,12.7 v46.76,12.7 v53.76,12.7 v60.87,12.7 v63.26,12.7 v72.14,12.7 | 19.76,17.07 16.83,20 15.93,20 v14.98,20.95 | v19.05,16.51 19.61,17.07 19.76,17.07
3V3EN  (via drill 0.33)
  Top 0.305: TP2.P$1 v76.83,27.62 U4.3 | v76.83,24.92 R21.2
  Bottom 0.305: v76.83,24.92 76.83,25.82 | 76.83,25.82 v76.83,27.62 | JP1.2 76.83,25.82
BATT_STAT  (via drill 0.33)
  Top 0.305: R17.1 TP3.P$1 C22.1 R1.2 v87.94,18.89 | v30.36,26.67 30.34,26.67 U$3.27 28.12,24.45 27.7,24.45 GND.27
  Bottom 0.305: v87.94,18.89 83.19,18.89 82.87,19.21 34.13,19.21 29.37,23.97 29.37,25.68 v30.36,26.67
D+
  Top 0.305: GND.4 20.34,19.21 19.49,19.21 U$3.4 18.38,18.1 14.29,18.1 13.67,17.48 R9.2
D-
  Top 0.305: GND.3 20.1,19.68 18.83,19.68 U$3.3 17.72,18.57 14.29,18.57 13.92,18.94 R10.2
DATA1  (via drill 0.33)
  Top 0.305: v19.57,28.42 U$3.37 21.75,26.23 21.75,25.39 GND.37 | v67.47,16.51 67.47,30.8 67.79,31.11 82.55,31.11 84.45,33.02 v87.95,33.02
  Bottom 0.305: v19.57,28.42 21.47,26.51 23.65,26.51 33.34,16.83 56.99,16.83 57.63,16.19 58.58,16.19 58.9,16.51 v67.47,16.51 | v87.95,33.02 ICSP1.4
DATA2  (via drill 0.33)
  Top 0.305: GND.36 22.23,25.62 22.23,26.89 U$3.36 v20.7,28.42 | v66.67,17.3 66.67,31.27 66.99,31.59 81.92,31.59 v82.87,32.54
  Bottom 0.305: v20.7,28.42 22.13,26.99 23.81,26.99 33.5,17.3 57.15,17.3 57.78,16.67 58.42,16.67 59.05,17.3 v66.67,17.3 | v82.87,32.54 83.34,33.02 ICSP1.3
FLASH_CS  (via drill 0.33)
  Top 0.305: v26.91,28.89 U$3.32 25.48,27.46 25.48,25.77 GND.32 | U$4.1 TP6.P$1 57.15,11.69 57.47,12.01 58.1,12.64 v58.1,17.46
  Bottom 0.305: v26.91,28.89 25.56,27.54 25.56,25.88 33.66,17.78 57.78,17.78 v58.1,17.46
GND  (via drill 0.33)
  Top 0.305: GND.35 22.78,25.77 22.78,27.46 U$3.35 | GND.43 19.95,22.94 18.25,22.94 U$3.43 | U$3.33 24.77,27.88 GND.33 | U$3.23 30.42,22.23 GND.23 | GND.5 20.57,18.73 20.14,18.73 U$3.5 | GND.15 26.51,17.8 26.51,16.95 U$3.15
  other vias: 38.96,26.42 52.77,24.99 24.13,28.89 4.06,25.4 4.06,39.88 4.06,10.92 92.46,10.92 92.08,24.13 92.46,39.88 38.45,31.5 8.26,40.01 88.01,38.23 89.22,7.3 45.72,3.14 48.26,3.14 50.8,3.14 53.34,3.14 67.31,5.05 70.48,5.05 73.66,5.05 76.83,5.05 70.48,3.46 73.66,3.46 80.01,6.32 85.47,15.08 89.53,14.57 73.03,24.42 70.48,24.42 70.8,29.18 4.06,13.34 4.06,23.02 80.64,24.42 11.43,5.08 70.01,10.45 15.24,5.08 79.85,16.16 59.59,31.02 36.42,26.42 65.41,24.42 75.56,24.42 82.23,24.42 80.64,29.18 82.23,29.18 36.42,30.23 43.18,3.14 40.64,3.14 33.02,3.14 27.3,3.14 25.4,4.41 34.92,4.41 41.91,4.41 46.99,4.41 52.07,4.41 54.61,4.41 49.53,4.41 44.45,4.41 27.3,10.13 33.02,10.13 30.16,11.24 13.34,20.92 57.69,24.35 68.9,29.18 15.24,12.35 11.43,20.92 19.68,4.45 33.88,30.23 31.34,30.23 32.61,28.32 35.15,28.32 33.02,23.5 35.56,11.4 74.61,7.43 89.22,4.73 92.39,7.27 11.43,40.29 9.53,42.2 85.09,39.66 87,41.56 13.34,26.96 66.83,10.45 72.07,10.45 79.38,10.13 79.34,17.81 95.09,19.02 95.09,16.16 95.09,21.88 88.27,26.04 18.41,28.89 13.34,28.86 38.42,21.11 19.05,12.35 11.43,12.35 60.23,24.35 14.61,16.8
  pour Bottom: 96.52,42.93 96.52,0 0,0 0,42.93 13.34,42.93 13.34,34.42 14.99,32.77 38.37,32.77 39.37,31.77 39.37,27.94 40.64,26.67 55.88,26.67 57.15,27.94 57.15,31.77 58.15,32.77 81.79,32.77 83.19,34.42 83.19,42.93
  pour Top: 96.52,42.93 96.52,0 0,0 0,42.93 13.34,42.93 13.34,34.42 14.99,32.77 38.37,32.77 39.37,31.77 39.37,27.94 40.64,26.67 55.88,26.67 57.15,27.94 57.15,31.77 58.15,32.77 81.79,32.77 83.19,34.42 83.19,42.93
ISOTHERMAL  (via drill 0.33)
  other vias: 65.66,51.69 65.66,47.5 30.73,50.29 30.73,47.5 30.73,35.81 50.8,36.83 66.29,36.07 30.73,48.9 30.73,51.69 65.66,50.29 65.66,48.9 64.01,36.07 68.58,36.83 28.45,35.81 33.02,36.83 15.24,36.83 50.8,34.29 45.72,33.02 81.03,35.56 48.26,41.91 21.59,37.47 39.37,37.47 57.15,37.47 74.93,37.47 28.83,39.88 32,40.01 64.14,39.88 67.56,39.75 30.73,46.1 30.73,44.7 30.73,43.31 30.73,41.91 30.73,40.51 47.5,51.69 48.9,51.69 47.5,47.5 48.9,47.5 65.66,46.1 65.66,44.7 65.66,43.31 65.66,41.91 65.66,40.51 30.73,37.72 29.34,37.72 27.94,37.72 32.13,37.72 48.26,46.48 45.47,39.62 45.72,36.07 45.72,34.54 44.2,33.53 52.07,33.02 49.78,35.56 47.24,50.42 49.28,50.42 50.04,33.02 41.91,36.83 64.26,37.34 66.29,37.34 66.55,39.62 81.28,39.88 15.24,40.13 15.49,35.05
  pour Top: 81.92,52.83 81.92,35.04 80.92,34.04 57.53,34.04 55.88,32.38 55.88,27.94 40.64,27.94 40.64,32.38 38.99,34.04 15.61,34.04 14.61,35.04 14.61,52.83
  pour Bottom: 81.92,52.83 14.61,52.83 14.61,35.04 15.61,34.04 38.99,34.04 40.64,32.38 40.64,27.94 55.88,27.94 55.88,32.38 57.53,34.04 80.92,34.04 81.92,35.04
LCD_A0  (via drill 0.33)
  Top 0.305: v49.76,16.03 X1.8 | GND.38 21.27,25.16 21.27,25.58 U$3.38 19.39,27.46 18.12,27.46 v17.62,27.96
  Bottom 0.305: v49.76,16.03 49.44,15.72 24.61,15.72 18.73,21.59 18.73,26.85 v17.62,27.96
LCD_BL  (via drill 0.33)
  Top 0.305: R19.2 54.61,19.91 v54.61,16.03 | GND.41 20.34,23.97 19.49,23.97 U$3.41 17.68,25.78 15.93,25.78 v15.24,26.47
  Bottom 0.305: v15.24,26.47 17.3,24.41 17.3,21.11 24.13,14.29 52.23,14.29 TP5.P$1 53.98,16.03 v54.61,16.03
LCD_CS  (via drill 0.33)
  Top 0.305: v51.76,16.03 X1.10 | GND.40 20.57,24.45 20.14,24.45 U$3.40 18.24,26.35 16.49,26.35 v15.24,27.6
  Bottom 0.305: v51.76,16.03 51.76,15.08 51.44,14.76 24.29,14.76 17.78,21.27 17.78,25.06 v15.24,27.6
LCD_RST  (via drill 0.33)
  Top 0.305: v50.76,15.56 X1.9 | GND.39 U$3.39 18.73,26.99 17.3,26.99 v16.35,27.94
  Bottom 0.305: v50.76,15.56 50.44,15.24 24.45,15.24 18.26,21.43 18.26,26.04 v16.35,27.94
MISO  (via drill 0.33)
  Top 0.305: v68.84,8.86 J1.7 | GND.11 23.49,15.3 U$3.11 22.1,13.9 v22.1,11.75 | v6.37,29.21 8.1,29.21 8.41,28.89 v8.41,28.1 | U$4.2 60.87,6.29 59.69,7.46 v59.69,8.86
  Bottom 0.305: v68.84,8.86 v59.69,8.86 22.73,8.86 22.1,9.49 v22.1,11.75 22.1,12.7 20.67,14.13 8.41,14.13 8.1,14.45 8.1,27.78 v8.41,28.1 | ICSP.1 v6.37,29.21
MOSI  (via drill 0.33)
  Top 0.305: U$4.5 v63.41,8.1 | X1.6 v47.76,8.1 | GND.10 22.78,17.41 22.78,15.71 U$3.10 21.27,14.21 v21.27,12.38 | J1.3 73.24,8.95 v72.39,8.1
  Bottom 0.305: v72.39,8.1 v63.41,8.1 v47.76,8.1 21.91,8.1 21.27,8.73 v21.27,12.38 21.27,12.86 20.48,13.65 7.94,13.65 7.62,13.97 7.62,28.57 7.94,28.89 8.57,28.89 8.89,29.21 8.89,32.7 9.21,33.02 ICSP.4
N$1
  Top 0.406: C4.1 73.44,28.07 U4.4
N$2
  Top 0.406: U3.1 R17.2
N$4
  Top 0.305: X1.11 52.76,20.01 R19.1
N$5
  Top 0.305: R31.2 61.4,36.93 60.4,37.93 60.4,39.69 60.08,40.01 58.1,40.01 57.78,40.32 57.78,42.86 58.1,43.18 61.71,43.18 U$8.P$1
  Top 0.61: R31.2 62.23,35.66 R36.1
N$7
  Top 0.305: R3.1 U3.5
N$10
  Bottom 0.61: SJ1.2 81.04,9.95 80.72,9.63 U$2.P$1
N$11
  Top 0.305: R27.1 52.9,36.93 53.9,37.93 53.9,39.69 54.22,40.01 56.2,40.01 56.52,40.32 56.52,42.86 56.2,43.18 53.09,43.18 U$7.P$1
  Top 0.61: R27.1 52.07,35.66 R35.2
N$12  (via drill 0.33)
  Top 0.305: Q1.1 v84.77,12.14 | v85.09,8.26 85.09,5.56 84.45,4.92 83.19,4.92 82.55,4.29 U2.2
  Bottom 0.305: v84.77,12.14 84.77,11.11 85.09,10.79 v85.09,8.26
N$13
  Top 0.305: R29.1 17.34,36.93 18.34,37.93 18.34,39.69 18.66,40.01 21.02,40.01 21.34,40.32 21.34,42.86 21.02,43.18 18.04,43.18 U$16.P$1
  Top 0.61: R29.1 16.51,35.66 R39.2
N$14
  Top 0.305: R33.2 25.84,36.93 24.84,37.93 24.84,39.69 24.52,40.01 22.54,40.01 22.23,40.32 22.23,42.86 22.54,43.18 26.66,43.18 U$17.P$1
  Top 0.61: R33.2 26.67,35.66 R41.1
N$15
  Top 0.305: GND.42 20.1,23.5 18.83,23.5 U$3.42 17.24,25.08 C3.1
N$16
  Top 0.305: R34.2 43.62,36.93 42.62,37.93 42.62,39.69 42.3,40.01 40.32,40.01 40.01,40.32 40.01,42.86 40.32,43.18 43.43,43.18 U$19.P$1
  Top 0.61: R34.2 44.45,35.66 R42.1
N$17
  Top 0.305: GND.2 19.95,20.24 18.25,20.24 U$3.2
N$20
  Top 0.305: R20.2 84.93,17.62 83.98,17.62 83.51,18.09 Q2.3
N$25
  Top 0.305: R6.2 21.11,2.7 20.8,2.38 17.3,2.38 16.98,2.7 IC3.7 16.98,7.9 Q5.1 S6.1
N$26
  Top 0.305: R5.2 81.7,15.79 Q2.1 81.6,19.05 81.92,19.37 82.23,19.37 82.55,19.68 Q3.3
N$27  (via drill 0.33)
  Top 0.305: R7.2 17.95,3.23 17.63,3.55 IC3.6 17.63,5.56 v18.57,6.51 | Q4.3 37,22.69 37.47,22.23 v38.73,22.23 | v59.69,22.46 59.69,21.59 59.53,21.43 59.53,15.72 v59.69,15.56 | v54.61,14.61 v54.61,6.51
  Bottom 0.305: v38.73,22.23 40.56,22.23 40.8,22.46 v59.69,22.46 | v59.69,15.56 55.56,15.56 v54.61,14.61 | v18.57,6.51 v54.61,6.51
N$28  (via drill 0.33)
  Top 0.305: R21.1 v76.83,6.35 | IC3.5 18.28,5.08 18.91,5.71 v19.71,5.71
  Bottom 0.305: v76.83,6.35 55.88,6.35 55.24,5.71 v19.71,5.71
N$31
  Top 0.305: U$1.PIN$2 6.77,18.94 | 6.77,18.94 R10.1 | Z2.2 6.77,18.94
N$33
  Top 0.305: U$1.PIN$3 6.77,18.29 | 6.77,18.29 9.75,18.29 10.21,17.83 10.4,17.64 10.56,17.48 R9.1 | Z1.2 6.77,18.29
N$34
  Top 0.305: R32.2 79.18,36.93 78.18,37.93 78.18,39.69 77.86,40.01 75.5,40.01 75.18,40.32 75.18,42.86 75.5,43.18 78.48,43.18 U$15.P$1
  Top 0.61: R32.2 80.01,35.66 R38.1
N$35
  Top 0.305: R28.1 70.68,36.93 71.68,37.93 71.68,39.69 72,40.01 73.98,40.01 74.3,40.32 74.3,42.86 73.98,43.18 69.86,43.18 U$9.P$1
  Top 0.61: R28.1 69.85,35.66 R37.2
N$37
  Top 0.305: C35.1 45.08,20.01 44.76,19.69 X1.3
N$38
  Top 0.305: X1.2 43.76,19.95 44.76,20.95 47.2,20.95 47.52,20.64 C35.2
N$39
  Top 0.305: C36.2 44.76,22.01 42.76,20.01 X1.1
N$40
  Top 0.305: R30.1 35.12,36.93 36.12,37.93 36.12,39.69 36.44,40.01 38.42,40.01 38.73,40.32 38.73,42.86 38.42,43.18 34.81,43.18 U$18.P$1
  Top 0.61: R30.1 34.29,35.66 R40.2
PWR_ONOFF
  Top 0.305: GND.22 30.42,20.95 U$3.22 31.48,20.74 R22.1 33.97,20.74 34.61,21.38 | TP1.P$1 34.61,21.38 | Q4.1 35.24,20.74 34.61,21.38
RESET  (via drill 0.33)
  Top 0.305: GND.13 25.48,17.41 25.48,15.71 U$3.13 27.5,13.7 v27.5,11.59 | v10.79,31.75 R4.1 4.91,33.66 5.55,34.29 v6.37,34.29
  Bottom 0.305: v6.37,34.29 ICSP.5 | v27.5,11.59 23.97,11.59 20.95,14.61 8.89,14.61 8.57,14.92 8.57,27.15 9.21,27.78 9.21,28.57 9.37,28.73 9.37,31.43 9.68,31.75 v10.79,31.75
RTC_BATT  (via drill 0.33)
  Top 0.305: U$14.6 v57.94,27.94 | v58.9,24.29 58.9,10.32 v58.42,9.84 | BAT1.PWR@1 v38.04,9.84
  Bottom 0.305: v57.94,27.94 58.58,27.94 58.9,27.62 v58.9,24.29 | v58.42,9.84 v38.04,9.84
RTC_INT  (via drill 0.33)
  Top 0.305: GND.20 28.08,19.76 29.35,19.76 U$3.20 30.86,18.26 37.78,18.26 v40.48,20.95 | v60.33,20.95 60.74,20.95 R2.2 61.91,21.59 62.23,21.91 62.23,26.35 62.87,26.99 62.87,27.62 63.18,27.94 U$14.3
  Bottom 0.305: v60.33,20.95 v40.48,20.95
RXLED
  Top 0.305: GND.8 21.75,17.8 21.75,16.95 U$3.8
SCK  (via drill 0.33)
  Top 0.305: v71.04,7.33 J1.5 | v62.13,7.33 U$4.6 | X1.7 v48.76,7.33 | GND.9 22.23,17.56 22.23,16.29 U$3.9 20.45,14.51 v20.45,11.75
  Bottom 0.305: v71.04,7.33 v62.13,7.33 v48.76,7.33 21.08,7.33 20.45,7.97 v20.45,11.75 20.45,12.89 20.16,13.18 7.46,13.18 7.14,13.49 7.14,29.05 7.46,29.37 8.1,29.37 8.41,29.69 8.41,32.7 8.1,33.02 ICSP.3
SCL  (via drill 0.33)
  Top 0.305: U$14.8 59.69,25.32 | GND.18 27.7,18.73 28.12,18.73 U$3.18 30.02,16.83 38.26,16.83 44.61,23.18 46.99,23.18 48.26,24.45 v48.9,24.45 49.21,24.13 IC1.8 55.56,24.13 R14.1 | 55.56,24.77 R14.1 | v48.9,27.3 48.9,38.42 49.21,38.73 49.85,38.73 50.16,39.05 50.16,44.16 49.88,44.45 49.53,44.45 49.21,44.77 U1.4 | v62.23,30.48 62.23,27.15 61.44,26.35 61.44,25.72 61.12,25.4 U$14.8 | U$14.8 56.67,25.4 56.25,24.98 R14.1
  Bottom 0.305: v48.9,27.3 v48.9,24.45 | ICSP1.1 v62.23,30.48
SD_CS  (via drill 0.33)
  Top 0.305: J1.2 TP7.P$1 | v28.04,28.89 U$3.31 26.04,26.89 26.04,25.62 GND.31
  Bottom 0.305: v28.04,28.89 26.04,26.89 26.04,26.04 33.81,18.26 74.34,18.26 TP7.P$1
SDA  (via drill 0.33)
  Top 0.305: GND.19 27.93,19.21 28.77,19.21 U$3.19 30.36,17.62 38.26,17.62 44.77,24.13 IC1.7 46.83,24.13 48.1,25.4 48.1,26.04 | 53.98,26.04 48.1,26.04 | R13.1 53.98,26.04 | v48.1,38.73 48.1,26.04 | v61.52,31.27 61.52,27.3 60.88,26.67 U$14.7 56.52,26.67 55.88,26.04 53.98,26.04 | U1.5 47.31,44.77 46.99,44.45 46.67,44.45 46.35,44.13 v46.35,38.73
  Bottom 0.305: ICSP1.2 90.15,31.43 89.83,31.75 83.5,31.75 83.03,31.27 v61.52,31.27 | v48.1,38.73 v46.35,38.73
SW_A  (via drill 0.33)
  Top 0.305: S3.3 90.97,37.97 91.61,37.34 R8.2 91.61,34.12 92.08,33.66 v92.08,27.3 | v68.26,22.38 v68.26,17.3 | v16.51,20.95 17.15,20.32 U$3.1 17.84,20.95 GND.1
  Bottom 0.305: v92.08,27.3 90.17,27.3 89.53,26.67 89.53,23.02 88.9,22.38 v68.26,22.38 | v68.26,17.3 68.26,14.13 67.63,13.49 24.29,13.49 16.83,20.95 v16.51,20.95
SW_B  (via drill 0.33)
  Top 0.305: R11.2 91.61,22.86 90.97,23.5 S2.3 v89.92,21.75 | GND.21 28.31,20.24 30,20.24 U$3.21 31.51,18.73 37.15,18.73 40.16,21.75 v41.12,21.75
  Bottom 0.305: v41.12,21.75 67.47,21.75 67.63,21.59 68.9,21.59 69.06,21.75 v89.92,21.75
SW_C  (via drill 0.33)
  Top 0.305: S1.3 90.97,9.02 91.61,9.65 R12.2 v91.61,16.51 | v30.32,27.78 U$3.28 GND.28
  Bottom 0.305: v30.32,27.78 28.89,26.35 28.89,23.81 33.97,18.73 82.71,18.73 84.93,16.51 v91.61,16.51
SW_D  (via drill 0.33)
  Top 0.305: S4.3 4.33,37.97 4.91,37.39 R15.2 4.91,34.51 4.06,33.66 4.06,30.96 18.73,30.96 19.05,31.27 v21.11,31.27 | v30.3,28.89 U$3.29 26.99,25.58 26.99,25.16 GND.29
  Bottom 0.305: v30.3,28.89 28.71,30.48 21.91,30.48 v21.11,31.27
SW_E  (via drill 0.33)
  Top 0.305: S5.3 5.6,27.3 4.91,27.99 R16.2 4.91,29.69 5.23,30 v19.84,30 | v29.17,28.89 U$3.30 26.51,26.23 26.51,25.39 GND.30
  Bottom 0.305: v19.84,30 28.06,30 v29.17,28.89
SW_PWR
  Top 0.305: GND.12 24.77,15.3 U$3.12 26.67,13.39 26.67,12.7 23.09,9.12 R18.1 17.09,9.97 Q5.3 9.58,9.97 TP9.P$1
TC1+  (via drill 0.33)
  Top 0.305: R39.1 v18.63,36.51 | v41.27,29.21 IC1.3
  Top 0.61: C16.1 20.32,35.66 C10.1 R39.1
  Bottom 0.305: v18.63,36.51 18.63,35.08 19.27,34.45 40.64,34.45 41.27,33.81 v41.27,29.21
TC1-  (via drill 0.33)
  Top 0.305: R41.2 v24.55,36.51 | v42.07,27.94 IC1.4
  Top 0.61: C15.1 22.86,35.66 C10.2 R41.2
  Bottom 0.305: v24.55,36.51 24.55,35.56 25.18,34.92 41.43,34.92 42.07,34.29 v42.07,27.94
TC2+  (via drill 0.33)
  Top 0.305: R40.1 v36.41,36.51 | v43.18,31.75 IC1.1
  Top 0.61: R40.1 C11.1 38.1,35.66 C14.1
  Bottom 0.305: v36.41,36.51 36.41,36.04 37.05,35.4 42.55,35.4 43.18,34.77 v43.18,31.75
TC2-
  Top 0.305: IC1.2 42.65,30.48 42.33,30.8 R42.2
  Top 0.61: R42.2 C11.2 40.64,35.66 C13.1
TC3+
  Top 0.305: IC1.13 53.87,30.48 54.19,30.8 R35.1
  Top 0.61: R35.1 C7.1 55.88,35.66 C17.2
TC3-  (via drill 0.33)
  Top 0.305: R36.2 v60.11,36.51 | v53.34,31.75 IC1.14
  Top 0.61: R36.2 C7.2 58.42,35.66 C24.2
  Bottom 0.305: v60.11,36.51 60.11,36.2 59.48,35.56 53.98,35.56 53.34,34.92 v53.34,31.75
TC4+  (via drill 0.33)
  Top 0.305: R37.1 v71.97,36.51 | IC1.11 v54.45,27.94
  Top 0.61: R37.1 C8.1 73.66,35.66 C25.2
  Bottom 0.305: v71.97,36.51 71.97,35.56 71.33,34.92 55.09,34.92 54.45,34.29 v54.45,27.94
TC4-  (via drill 0.33)
  Top 0.305: IC1.12 v55.24,29.21 | R38.2 v77.89,36.51
  Top 0.61: R38.2 C8.2 76.2,35.66 C37.2
  Bottom 0.305: v55.24,29.21 55.24,33.81 55.88,34.45 77.25,34.45 77.89,35.08 v77.89,36.51
VBAT
  Top 0.305: 86.04,9.95 86.04,10.16 | Q2.2 83.4,15.79
  Top 0.406: U3.3 | Q1.3 82.55,13.12 R5.1 83.4,15.79
  Top 0.61: U3.3 86.04,10.16 C9.1 | Q1.3 TP14.P$1 86.04,9.95
  Bottom 0.61: TP14.P$1 SJ1.1
VBAT_EN  (via drill 0.33)
  Top 0.305: v31.49,25.56 U$3.25 29.43,23.5 28.16,23.5 GND.25 | R23.2 v79.38,20.49 Q3.1
  Bottom 0.305: v31.49,25.56 30.8,24.86 30.8,23.81 34.45,20.16 78.41,20.16 78.74,20.49 v79.38,20.49
VBAT_SENSE  (via drill 0.33)
  Top 0.305: R24.1 R20.1 84.93,19.37 85.09,19.53 TP4.P$1 C23.1 | v30.36,25.56 U$3.26 28.77,23.97 27.93,23.97 GND.26
  Bottom 0.305: v30.36,25.56 30.36,23.61 34.29,19.68 82.87,19.68 83.19,20 TP4.P$1
VBUS  (via drill 0.33)
  Top 0.305: U4.1 78.11,25.72 C12.1 | v22.3,3.26 22.3,1.85 21.98,1.53 R6.1 R7.1 | C28.1 TP12.P$1 16.33,3.26 IC3.8
  Top 0.61: v79.53,25.82 78.58,25.82 | v79.53,25.82 C1.1 C2.1 82.63,25.82 | v79.53,25.82 C12.1 78.11,12.14 | Q1.2 78.11,12.14 | v78.11,3.49 78.11,12.14
  Top 0.813: TP12.P$1 D2.C
  Bottom 0.305: JP1.1 v79.53,25.82 | 18.73,3.26 18.41,3.26
  Bottom 0.61: TP12.P$1 18.41,3.26 v22.3,3.26 23.34,2.22 76.83,2.22 v78.11,3.49
VBUS_IN  (via drill 0.33)
  Top 0.305: U2.3 v82.23,1.27 | C6.1 TP11.P$1 U3.4 | GND.7 21.27,18.02 21.27,17.6 U$3.7 19.07,15.4 v18.73,15.4 | v11.41,29.21 9.84,29.21 9.21,28.57 9.21,26.99 8.57,26.35 v5.4,26.35 | v9.53,15.4 v5.4,15.4 | v5.4,20.32 5.4,19.91 5.08,19.59 U$1.PIN$1 | R25.2 v9.21,1.27
  Top 0.406: U3.4
  Top 1.016: D2.A v9.21,1.27
  Bottom 0.305: TP11.P$1 86.04,1.59 85.72,1.27 v82.23,1.27 | ICSP.2 v11.41,29.21 | v5.4,26.35 v5.4,20.32 | v18.73,15.4 v9.53,15.4
  Bottom 1.016: v82.23,1.27 v9.21,1.27 9.21,6.67 arc90 7.62,8.26 6.67,8.26 arc-90 5.4,9.53 v5.4,15.4 v5.4,20.32
XTAL1
  Top 0.305: GND.17 U$3.17 29.59,16.13 arc45 29.82,16.03 32.63,16.03 arc-90 32.95,15.72 Y1.1
XTAL2
  Top 0.305: GND.16 26.99,18.02 26.99,17.6 U$3.16 29.73,14.86 arc45 29.96,14.76 Y1.3

### Text on the board
tPlace: ISO- / THERM | +1 | +2 | +3 | +4 | A | D | ADC | RTC | 3V3_EN | B | E | PWR_ONOFF | VBAT_SENSE | SD_CS | 3.3V | GND | BATT_ / STAT | LCD_BL | C | SW_PWR | LCD | VBAT | PWR | SD_CARD | FLASH | VBUS_IN | VBUS | FLASH_CS
bPlace: ISO- / THERM | +1 | +2 | +3 | +4 | Pax Instruments | GND | GND | 3.3V | RST | T400 / v0.14 | paxinstruments.com/products/sku927 | SCK | DATA1 | MOSI | DATA2 | MISO | SDA | VCC | 3V3_EN | SCL | 12c Addresses: / - ADC MCP3424 0x69 / - Temp MCP9800 0x48 / - RTC DS3231 0x68 | PWR_ONOFF | ALWAYS ON / JUMPER | Arduino pin map / / D0 RTC_INT / D1 SW_B / D2 SDA / D3 SCL / D4 VBAT_EN / D5 SD_CS / D6 BATT_STAT / D7 SW_A / D8 SW_C / D9 SW_D / D10 SW_E / D11 SW_PWR | SD_CS | VBAT_SENSE | D12 VBAT_SENSE / D13 FLASH_CS / D14 MISO / D15 SCK / D16 MOSI / D17 RXLED / A0 DATA2 / A1 DATA1 / A2 LCD_A0 / A3 LCD_RST / A4 LCD_CS / A5 LCD_BL | 3.3V | - | LCD_BL | GND | BATT_STAT | SW_PWR | VBAT | + | VBUS_IN | VBUS | FLASH_CS
tNames: + | + | + | +